# Altium schematic sheet Audio.SchDoc
size A3; SheetNumber: 5; SheetTotal: 6
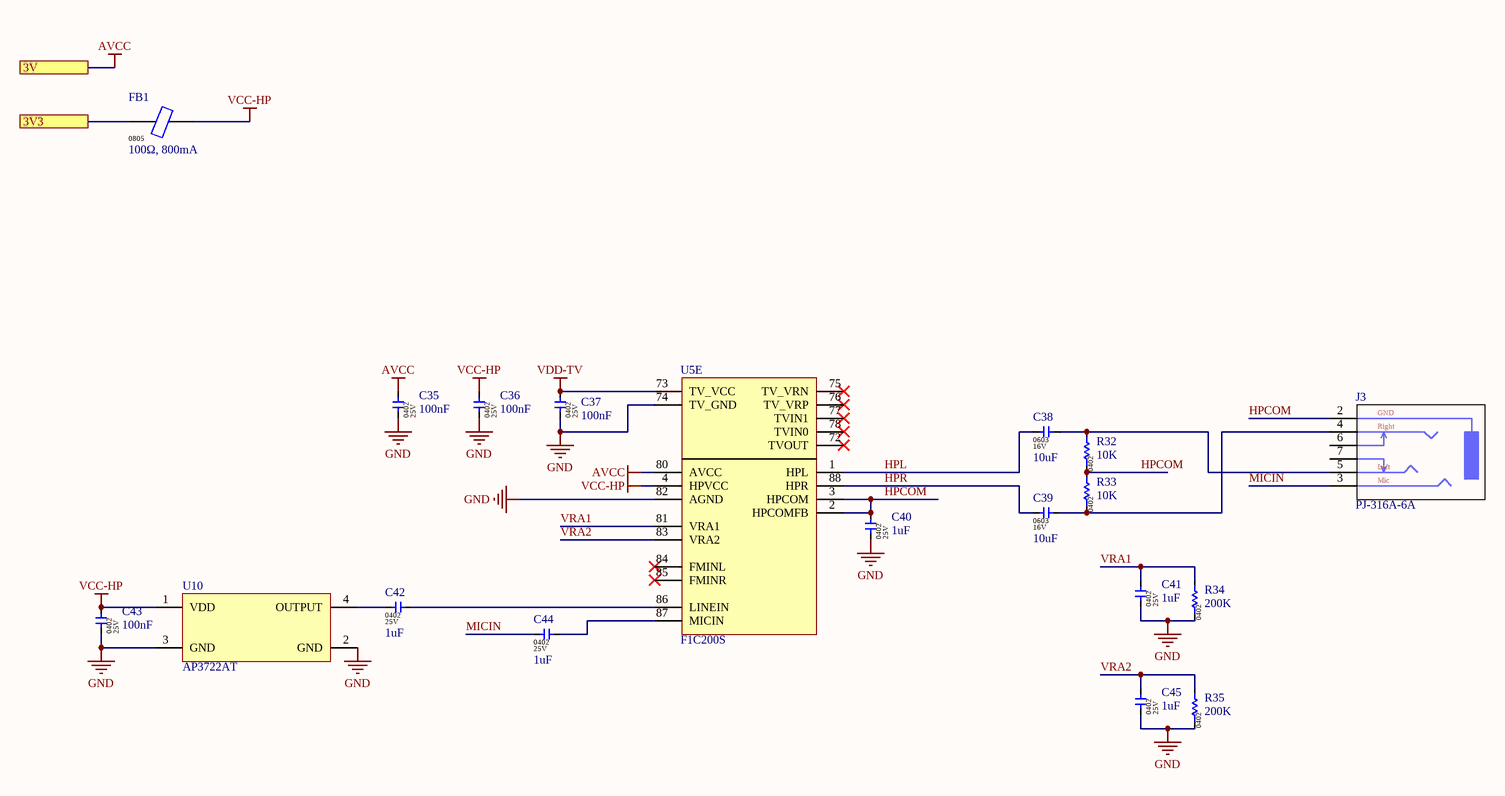
[diagram p0: Audio.SchDoc]

## Parts
C35  100nF  [CAP-0402]
C36  100nF  [CAP-0402]
C37  100nF  [CAP-0402]
C38  10uF  [CAP-0603]
C39  10uF  [CAP-0603]
C40  1uF  [CAP-0402]
C41  1uF  [CAP-0402]
C42  1uF  [CAP-0402]
C43  100nF  [CAP-0402]
C44  1uF  [CAP-0402]
C45  1uF  [CAP-0402]
FB1  100Ω, 800mA  [Ferrite-0805]
J3  PJ-316A-6A  [Audio 3.5mm, 6 pin]
R32  10K  [RES-0402]
R33  10K  [RES-0402]
R34  200K  [RES-0402]
R35  200K  [RES-0402]
U5  F1C200S  [F1Cx00s]  (part E of 6)
U10  AP3722AT  [AP3722AT]

## Ports
3V, 3V3

## Nets
AVCC: C35.2 U5.80(AVCC) ; port 3V
GND: C35.1 C36.1 C37.1 C40.1 C41.1 C43.1 C45.1 R34.1 R35.1 U5.74(TV_GND) U5.82(AGND) U10.2(GND) U10.3(GND)
VCC-HP: C36.2 C43.2 FB1.2 U5.4(HPVCC) U10.1(VDD)
VDD-TV: C37.2 U5.73(TV_VCC)
3V3: FB1.1 ; port 3V3
HPCOM: C40.2 J3.2 R32.1 R33.2 U5.2(HPCOMFB) U5.3(HPCOM)
HPL: C38.1 U5.1(HPL)
HPR: C39.1 U5.88(HPR)
MICIN: C44.1 J3.3
VRA1: C41.2 R34.2 U5.81(VRA1)
VRA2: C45.2 R35.2 U5.83(VRA2)
NetC38_2: C38.2 J3.5 R32.2
NetC39_2: C39.2 J3.4 R33.1
NetC42_1: C42.1 U10.4(OUTPUT)
NetC42_2: C42.2 U5.86(LINEIN)
NetC44_2: C44.2 U5.87(MICIN)

Not connected (* = marked no-connect by the designer): J3 6 7; U5 72(TVOUT)* 75(TV_VRN)* 76(TV_VRP)* 77(TVIN1)* 78(TVIN0)* 84(FMINL)* 85(FMINR)*

## Notes on the sheet
- (in symbol PJ-316A-6A) GND; Right; Left; Mic

## Library data of the parts
C35-C37 C43 = 0402X104K250CT: 100nF ±10% 25V X5R 0402 Multilayer Ceramic Capacitors MLCC - SMD/SMT RoHS; Manufacture: WALSIN; Package / Case: 0402; Component type: Capacitor; Manufacture part: 0402X104K250CT; Capacitor value: 100nF; Voltage: 25V; Package: 0402
C38 C39 = 0603X106M160CT: 16V 10uF X5R ±20% 0603 Multilayer Ceramic Capacitors MLCC - SMD/SMT ROHS; Manufacture: WALSIN; Package / Case: 0402; Component type: Capacitor; Manufacture part: 0603X106M160CT; Capacitor value: 10uF; Voltage: 16V; Package: 0603
C40-C42 C44 C45 = 0402X105K250CT: 25V 1uF X5R ±10% 0402 Multilayer Ceramic Capacitors MLCC - SMD/SMT ROHS; Manufacture: WALSIN; Package / Case: 0402; Component type: Capacitor; Manufacture part: 0402X105K250CT; Capacitor value: 1uF; Voltage: 25V; Package: 0402
FB1 = GZ2012D101TF: 100Ω @ 100MHz 800mA 1 150mΩ 0805 Ferrite Beads RoHS; Manufacture: SUNLORD; Manufacture part: GZ2012D101TF; Package: 0805; Value: 100Ω, 800mA
J3 = PJ-316A-6A: 3.5mm SMD Headphone Holder 6 Female Horizontal SMD Audio & Video Connectors RoHS; Manufacture: Korean Hroparts Elec; Manufacture part: PJ-316A-6A; Type: Audio 3.5mm; Datasheet: https://datasheet.lcsc.com/lcsc/1810121710_Korean-Hroparts-Elec-PJ-316A-6A_C128987.pdf
R32 R33 = WR04X1002FTL: 10kΩ ±1% 1/16W ±100ppm/℃ 0402 Chip Resistor - Surface Mount RoHS; Manufacture: WALSIN; Package / Case: 0201; Component type: Resistor; Manufacture part: WR04X1002FTL; Resistor value: 10K; Package: 0402
R34 R35 = WR04X2003FTL: 200kΩ ±1% 1/16W ±100ppm/℃ 0402 Chip Resistor - Surface Mount RoHS; Manufacture: WALSIN; Package / Case: 0201; Component type: Resistor; Manufacture part: WR04X2003FTL; Resistor value: 200K; Package: 0402
U5 = F1C200S: The Allwinner F1C200s is a small SoC with an ARM926EJ-S CPU core and 64MB of embedded DDR SDRAM.; Manufacture part: F1C200S; Manufacture: Allwinner; Package: QFN-88 (10x10); Datasheet: https://linux-sunxi.org/images/1/11/Allwinner_F1C200s_Datasheet_V1.0.pdf
U10 = AP3722AT: SMD,3.76x2.24x1.1mm MEMS Microphones ROHS; Manufacture: ALLPOWER(ShenZhen Quan Li Semiconductor); Manufacture part: AP3722AT; Package: N/A; Datasheet: https://datasheet.lcsc.com/lcsc/2011200934_ALLPOWER-ShenZhen-Quan-Li-Semiconductor-AP3722AT_C918198.pdf